# Altium schematic sheet Drivers.SchDoc: LEDDRV_DRIVERS
size A4; SheetNumber: 3; SheetTotal: 3
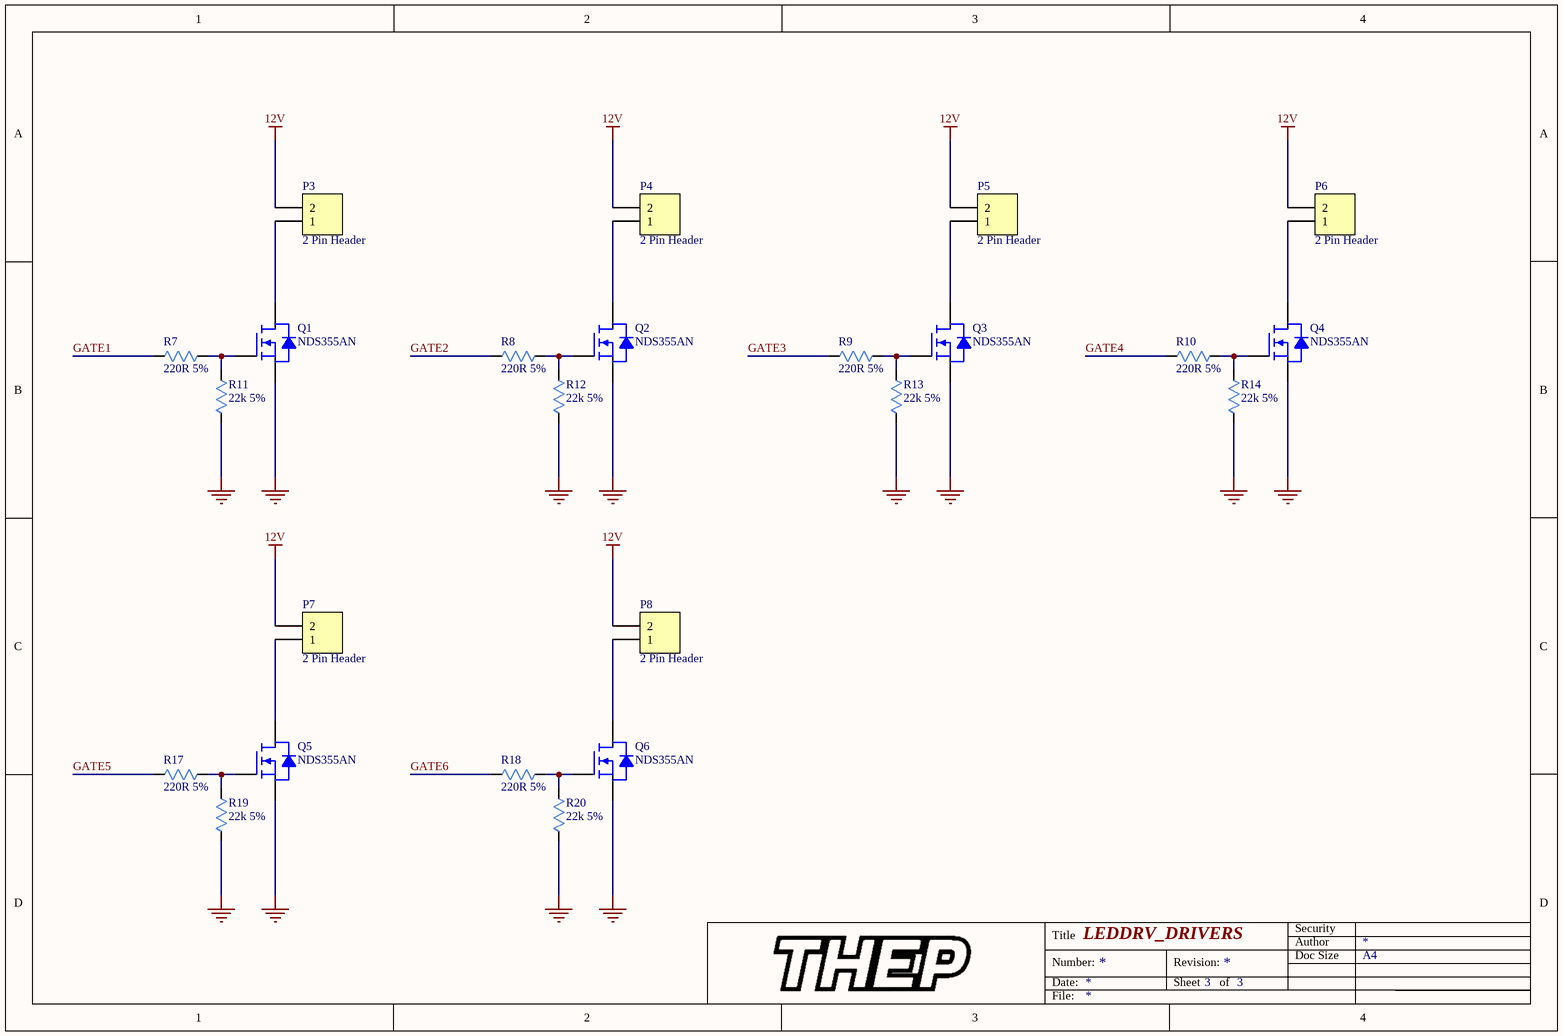
[diagram p0: Drivers.SchDoc]

## Parts
P3  2 Pin Header  [PCB - CONNECTOR - HEADER PIN 02]
P4  2 Pin Header  [PCB - CONNECTOR - HEADER PIN 02]
P5  2 Pin Header  [PCB - CONNECTOR - HEADER PIN 02]
P6  2 Pin Header  [PCB - CONNECTOR - HEADER PIN 02]
P7  2 Pin Header  [PCB - CONNECTOR - HEADER PIN 02]
P8  2 Pin Header  [PCB - CONNECTOR - HEADER PIN 02]
Q1  NDS355AN  [SOT95P240X120-3N]
Q2  NDS355AN  [SOT95P240X120-3N]
Q3  NDS355AN  [SOT95P240X120-3N]
Q4  NDS355AN  [SOT95P240X120-3N]
Q5  NDS355AN  [SOT95P240X120-3N]
Q6  NDS355AN  [SOT95P240X120-3N]
R7  220R 5%  [RES 0402_1005]
R8  220R 5%  [RES 0402_1005]
R9  220R 5%  [RES 0402_1005]
R10  220R 5%  [RES 0402_1005]
R11  22k 5%  [RES 0402_1005]
R12  22k 5%  [RES 0402_1005]
R13  22k 5%  [RES 0402_1005]
R14  22k 5%  [RES 0402_1005]
R17  220R 5%  [RES 0402_1005]
R18  220R 5%  [RES 0402_1005]
R19  22k 5%  [RES 0402_1005]
R20  22k 5%  [RES 0402_1005]

## Nets
12V: P3.2 P4.2 P5.2 P6.2 P7.2 P8.2
GND: Q1.3(S) Q2.3(S) Q3.3(S) Q4.3(S) Q5.3(S) Q6.3(S) R11.1 R12.1 R13.1 R14.1 R19.1 R20.1
GATE1: R7.1
GATE2: R8.1
GATE3: R9.1
GATE4: R10.1
GATE5: R17.1
GATE6: R18.1
NetP3_1: P3.1 Q1.2(D)
NetP4_1: P4.1 Q2.2(D)
NetP5_1: P5.1 Q3.2(D)
NetP6_1: P6.1 Q4.2(D)
NetP7_1: P7.1 Q5.2(D)
NetP8_1: P8.1 Q6.2(D)
NetQ1_1: Q1.1(G) R7.2 R11.2
NetQ2_1: Q2.1(G) R8.2 R12.2
NetQ3_1: Q3.1(G) R9.2 R13.2
NetQ4_1: Q4.1(G) R10.2 R14.2
NetQ5_1: Q5.1(G) R17.2 R19.2
NetQ6_1: Q6.1(G) R18.2 R20.2

## Notes on the sheet
- Title
- Number:
- Date:
- Revision:
- Sheet
- of
- Author
- Security
- Doc Size
- A4
- File:

## Library data of the parts
Q1-Q6 = NDS355AN: N-CHANNEL ENHANCEMENT MODE MOSFET; pin to pad: 2>3 3>2; Full Part Number: NDS355AN; Value: NDS355AN
R7-R14 R17-R20 = Resistor: SMT Resistor
  R7-R10 R17 R18: Value: 220R 5%
  R11-R14 R19 R20: Value: 22k 5%
P3-P8 = 2 Pin Header: Value: 2 Pin Header